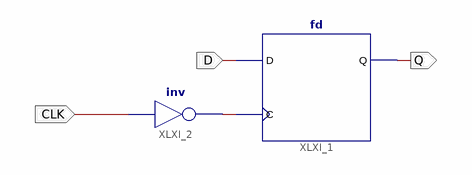
[diagram p0: schematic sheet 1]
// Xilinx ISE schematic Buffer1Bit.sch (spartan6) as structural Verilog: 2 symbols, 3 ports
module Buffer1Bit (
  input  D,
  input  CLK,
  output Q
);

  wire XLXN_3;

  fd XLXI_1 (.C(XLXN_3), .D(D), .Q(Q));
  not XLXI_2 (XLXN_3, CLK);
endmodule
